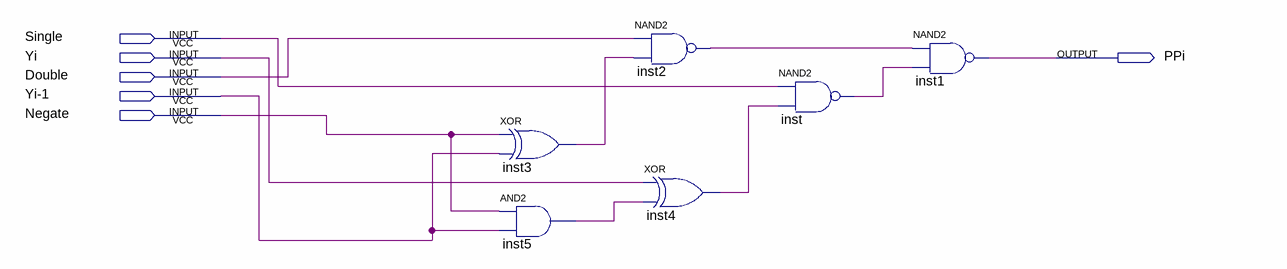
[diagram p0: schematic sheet]
// Quartus schematic PPgen_vLC.bdf as structural Verilog: 6 symbols, 6 pins
module PPgen_vLC (
  input  Single,
  input  Yi,
  input  Double,
  input  \Yi-1 ,
  input  Negate,
  output PPi
);

  wire inst2_out, inst3_out, inst4_out, inst5_out, inst_out;

  xor inst3 (inst3_out, Negate, \Yi-1 );
  and inst5 (inst5_out, Negate, \Yi-1 );
  nand inst2 (inst2_out, Double, inst3_out);
  xor inst4 (inst4_out, Yi, inst5_out);
  nand inst (inst_out, Single, inst4_out);
  nand inst1 (PPi, inst2_out, inst_out);
endmodule
